# Altium schematic sheet 780-00055, rev1, Pg1, SCH, NRES Temp Meas, 8-Chan RTD .SchDoc
size B; PageSetup: Record=PageOptions|CenterHorizontal=True|CenterVertical=True|PrintScale=1.09|XCorrection=1.00|YCorrection=1.00|PrintKind=0|BorderSize=5000000|LeftOffset=0|BottomOffset=0|Orientation=2|PaperLength=1000|PaperWidth=1000|Scale=100|PaperSource=7|PrintQuality=-4|MediaType=1|DitherType=10|PaperKind=Ledger|PrintScaleMode=1
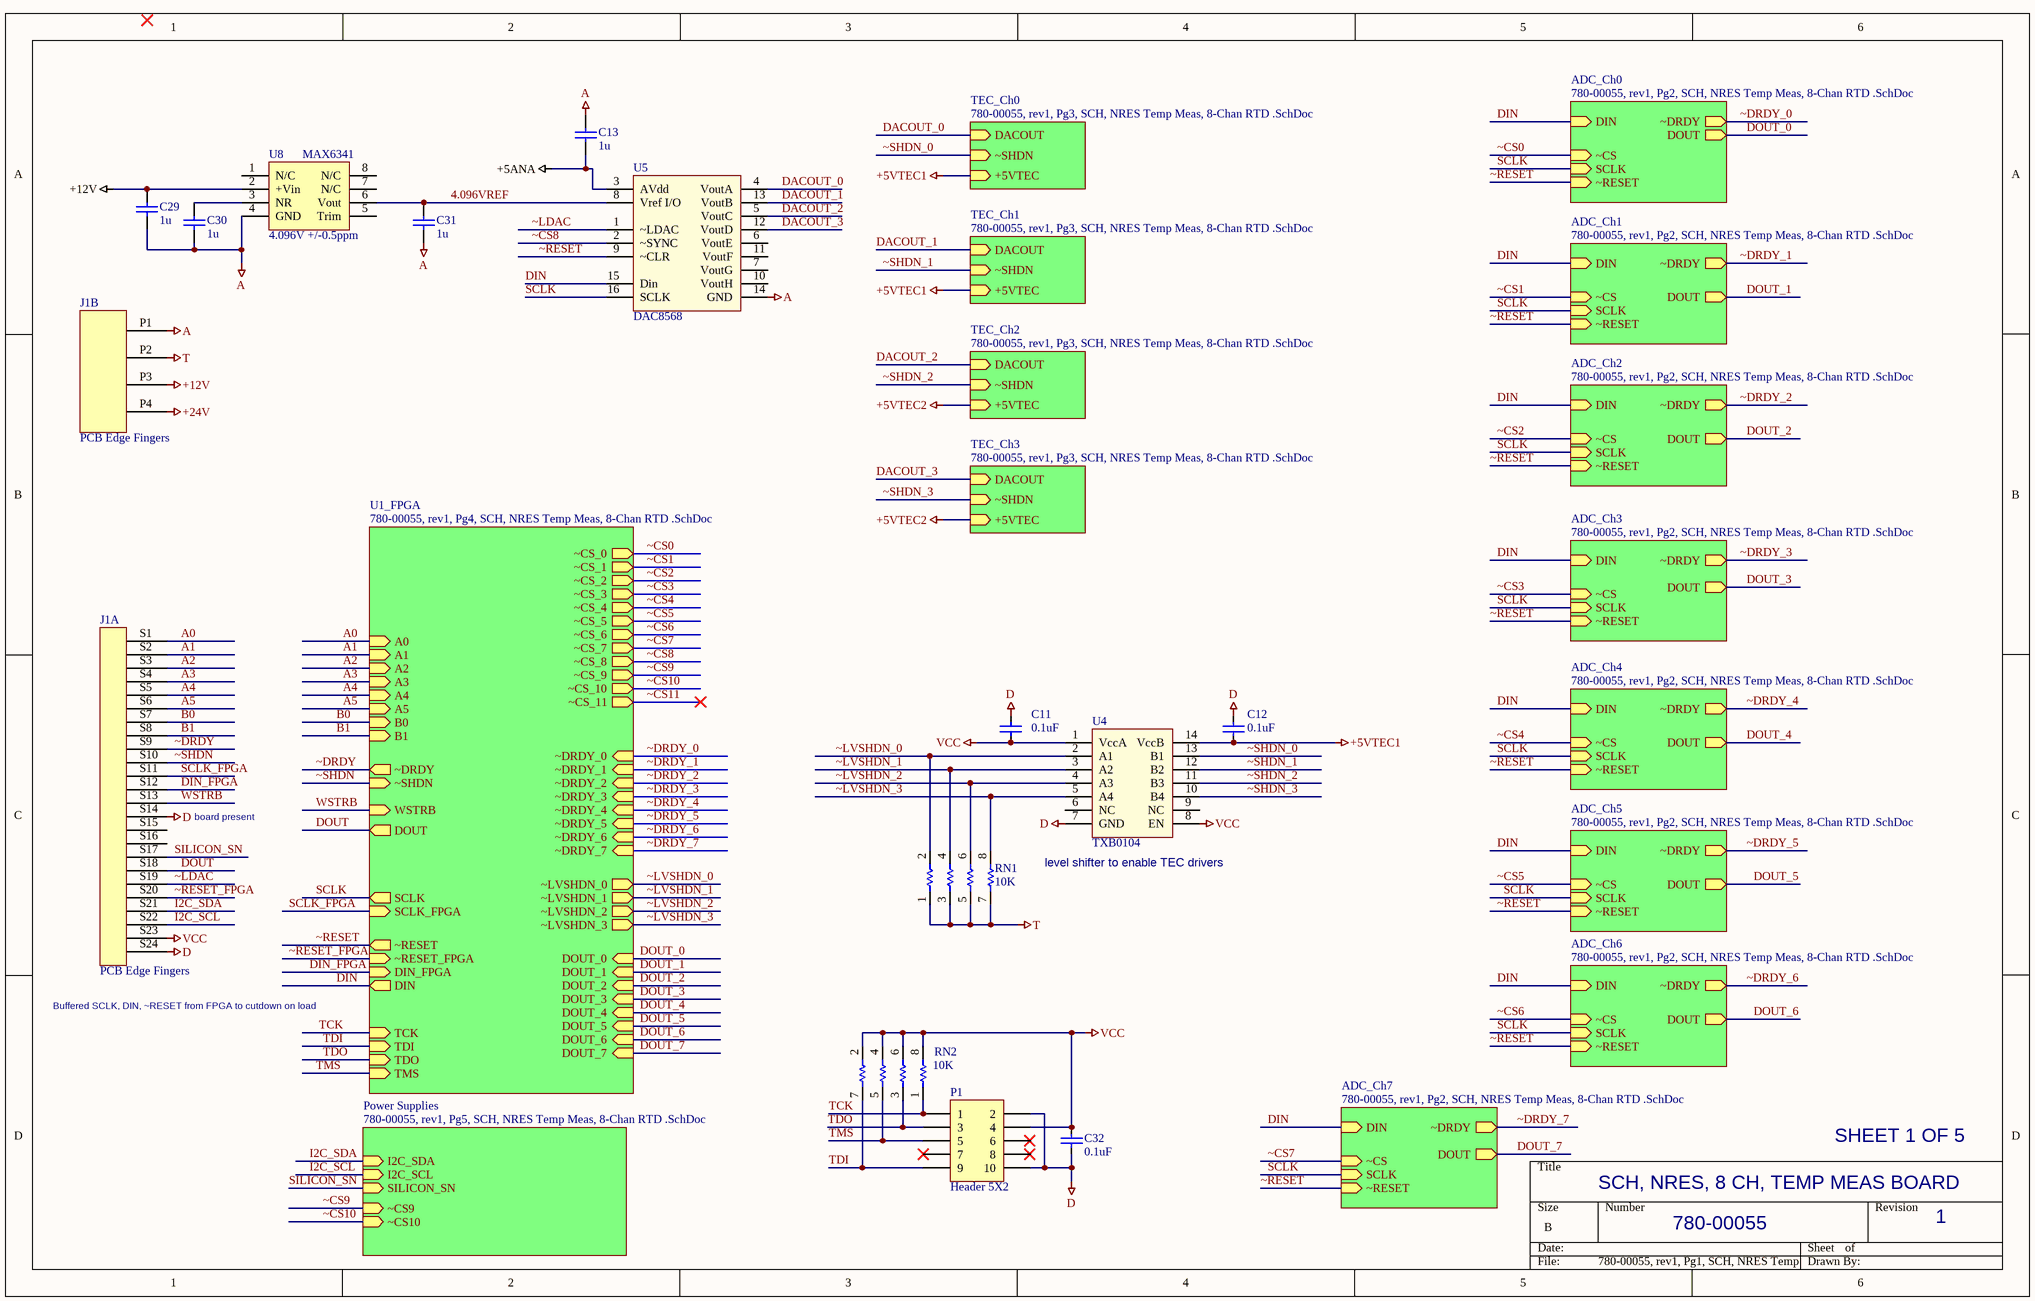
[diagram p0: 780-00055, rev1, Pg1, SCH, NRES Temp Meas, 8-Chan RTD .SchDoc]

## Parts
C11  value 0.1uF  [SMD_0805]  (hidden comment: Cap SMD)
C12  value 0.1uF  [SMD_0805]  (hidden comment: Cap SMD)
C13  1u  [SMD_0805]
C29  1u  [SMD_0805]
C30  1u  [SMD_0805]
C31  1u  [SMD_0805]
C32  value 0.1uF  [SMD_0805]  (hidden comment: Cap SMD)
J1  PCB Edge Fingers  [PCB EDGE, MOLEX 46114]  (parts A,B of 2)
P1  Header 5X2  [HDR2X5]
RN1  value 10K  [RES ARRAY 0603 x 4]  (hidden comment: RES ARRAY  x4 10K)
RN2  value 10K  [RES ARRAY 0603 x 4]  (hidden comment: RES ARRAY  x4)
U4  TXB0104  [TSSOP14]
U5  DAC8568  [TSSOP16]
U8  4.096V +/-0.5ppm  value MAX6341  [SO-8_M]

## Sub-sheets
ADC_Ch0 = 780-00055, rev1, Pg2, SCH, NRES Temp Meas, 8-Chan RTD .SchDoc: SCLK (in), ~RESET (in), DIN (in), ~DRDY (out), DOUT (out), ~CS (in)
ADC_Ch1 = 780-00055, rev1, Pg2, SCH, NRES Temp Meas, 8-Chan RTD .SchDoc: SCLK (in), ~RESET (in), DIN (in), ~DRDY (out), ~CS (in), DOUT (out)
ADC_Ch2 = 780-00055, rev1, Pg2, SCH, NRES Temp Meas, 8-Chan RTD .SchDoc: SCLK (in), ~RESET (in), DIN (in), ~DRDY (out), ~CS (in), DOUT (out)
ADC_Ch3 = 780-00055, rev1, Pg2, SCH, NRES Temp Meas, 8-Chan RTD .SchDoc: SCLK (in), ~RESET (in), DIN (in), ~DRDY (out), ~CS (in), DOUT (out)
ADC_Ch4 = 780-00055, rev1, Pg2, SCH, NRES Temp Meas, 8-Chan RTD .SchDoc: SCLK (in), ~RESET (in), DIN (in), ~DRDY (out), ~CS (in), DOUT (out)
ADC_Ch5 = 780-00055, rev1, Pg2, SCH, NRES Temp Meas, 8-Chan RTD .SchDoc: SCLK (in), ~RESET (in), DIN (in), ~DRDY (out), ~CS (in), DOUT (out)
ADC_Ch6 = 780-00055, rev1, Pg2, SCH, NRES Temp Meas, 8-Chan RTD .SchDoc: SCLK (in), ~RESET (in), DIN (in), ~DRDY (out), ~CS (in), DOUT (out)
ADC_Ch7 = 780-00055, rev1, Pg2, SCH, NRES Temp Meas, 8-Chan RTD .SchDoc: SCLK (in), ~RESET (in), DIN (in), ~DRDY (out), ~CS (in), DOUT (out)
Power Supplies = 780-00055, rev1, Pg5, SCH, NRES Temp Meas, 8-Chan RTD .SchDoc: I2C_SDA (in), I2C_SCL (in), SILICON_SN (in), ~CS9 (in), ~CS10 (in)
TEC_Ch0 = 780-00055, rev1, Pg3, SCH, NRES Temp Meas, 8-Chan RTD .SchDoc: ~SHDN (in), DACOUT (in), +5VTEC (in)
TEC_Ch1 = 780-00055, rev1, Pg3, SCH, NRES Temp Meas, 8-Chan RTD .SchDoc: ~SHDN (in), DACOUT (in), +5VTEC (in)
TEC_Ch2 = 780-00055, rev1, Pg3, SCH, NRES Temp Meas, 8-Chan RTD .SchDoc: ~SHDN (in), DACOUT (in), +5VTEC (in)
TEC_Ch3 = 780-00055, rev1, Pg3, SCH, NRES Temp Meas, 8-Chan RTD .SchDoc: ~SHDN (in), DACOUT (in), +5VTEC (in)
U1_FPGA = 780-00055, rev1, Pg4, SCH, NRES Temp Meas, 8-Chan RTD .SchDoc: ~CS_0 (out), ~CS_1 (out), ~CS_2 (out), ~CS_3 (out), ~CS_4 (out), ~CS_5 (out), ~CS_6 (out), ~CS_7 (out), ~CS_8 (out), ~DRDY (out), ~DRDY_0 (in), ~DRDY_1 (in), ~DRDY_2 (in), ~DRDY_3 (in), ~DRDY_4 (in), ~DRDY_5 (in), ~DRDY_6 (in), ~DRDY_7 (in), ~LVSHDN_0 (out), ~LVSHDN_1 (out), ~LVSHDN_2 (out), ~LVSHDN_3 (out), ~SHDN (in), A0 (in), A1 (in), A2 (in), A3 (in), A4 (in), A5 (in), B0 (in), B1 (in), TCK (in), TDI (in), TDO (in), TMS (in), WSTRB (in), DOUT (out), ~CS_9 (out), ~CS_10 (out), ~CS_11 (out), DOUT_2 (in), DOUT_4 (in), DOUT_1 (in), DOUT_6 (in), DOUT_3 (in), DOUT_7 (in), DOUT_0 (in), DOUT_5 (in), SCLK (out), SCLK_FPGA (in), ~RESET (out), ~RESET_FPGA (in), DIN_FPGA (in), DIN (out)

## Nets
+5ANA: C13.2 U5.3(AVdd)
+5VTEC1: C12.1 U4.14(VccB) ; sheet TEC_Ch0/+5VTEC, sheet TEC_Ch1/+5VTEC
+5VTEC2: sheet TEC_Ch2/+5VTEC, sheet TEC_Ch3/+5VTEC
+12V: C29.1 J1.P3(S27) U8.2(+Vin)
+24V: J1.P4(S28)
A: C13.1 C29.2 C30.2 C31.2 J1.P1(S25) U5.14(GND) U8.4(GND)
D: C11.2 C12.2 C32.1 J1.S14 J1.S24 P1.2 P1.10 U4.7(GND)
T: J1.P2(S26) RN1.1 RN1.3 RN1.5 RN1.7
VCC: C11.1 C32.2 J1.S23 P1.4 RN2.2 RN2.4 RN2.6 RN2.8 U4.1(VccA) U4.8(EN)
4.096VREF: C31.1 U5.8(Vref_I/O) U8.6(Vout)
A0: J1.S1 ; sheet U1_FPGA/A0
A1: J1.S2 ; sheet U1_FPGA/A1
A2: J1.S3 ; sheet U1_FPGA/A2
A3: J1.S4 ; sheet U1_FPGA/A3
A4: J1.S5 ; sheet U1_FPGA/A4
A5: J1.S6 ; sheet U1_FPGA/A5
B0: J1.S7 ; sheet U1_FPGA/B0
B1: J1.S8 ; sheet U1_FPGA/B1
DACOUT_0: U5.4(VoutA) ; sheet TEC_Ch0/DACOUT
DACOUT_1: U5.13(VoutB) ; sheet TEC_Ch1/DACOUT
DACOUT_2: U5.5(VoutC) ; sheet TEC_Ch2/DACOUT
DACOUT_3: U5.12(VoutD) ; sheet TEC_Ch3/DACOUT
DIN: U5.15(Din) ; sheet ADC_Ch3/DIN, sheet ADC_Ch4/DIN, sheet ADC_Ch5/DIN, sheet ADC_Ch6/DIN, sheet ADC_Ch7/DIN, sheet ADC_Ch0/DIN, sheet ADC_Ch1/DIN, sheet ADC_Ch2/DIN, sheet U1_FPGA/DIN
DIN_FPGA: J1.S12 ; sheet U1_FPGA/DIN_FPGA
DOUT: J1.S18 ; sheet U1_FPGA/DOUT
DOUT_0: sheet ADC_Ch0/DOUT, sheet U1_FPGA/DOUT_0
DOUT_1: sheet ADC_Ch1/DOUT, sheet U1_FPGA/DOUT_1
DOUT_2: sheet ADC_Ch2/DOUT, sheet U1_FPGA/DOUT_2
DOUT_3: sheet ADC_Ch3/DOUT, sheet U1_FPGA/DOUT_3
DOUT_4: sheet ADC_Ch4/DOUT, sheet U1_FPGA/DOUT_4
DOUT_5: sheet ADC_Ch5/DOUT, sheet U1_FPGA/DOUT_5
DOUT_6: sheet ADC_Ch6/DOUT, sheet U1_FPGA/DOUT_6
DOUT_7: sheet ADC_Ch7/DOUT, sheet U1_FPGA/DOUT_7
I2C_SCL: J1.S22 ; sheet Power Supplies/I2C_SCL
I2C_SDA: J1.S21 ; sheet Power Supplies/I2C_SDA
SCLK: U5.16(SCLK) ; sheet ADC_Ch3/SCLK, sheet ADC_Ch4/SCLK, sheet ADC_Ch5/SCLK, sheet ADC_Ch6/SCLK, sheet ADC_Ch7/SCLK, sheet ADC_Ch0/SCLK, sheet ADC_Ch1/SCLK, sheet ADC_Ch2/SCLK, sheet U1_FPGA/SCLK
SCLK_FPGA: J1.S11 ; sheet U1_FPGA/SCLK_FPGA
SILICON_SN: J1.S17 ; sheet Power Supplies/SILICON_SN
TCK: P1.1 RN2.1 ; sheet U1_FPGA/TCK
TDI: P1.9 RN2.7 ; sheet U1_FPGA/TDI
TDO: P1.3 RN2.3 ; sheet U1_FPGA/TDO
TMS: P1.5 RN2.5 ; sheet U1_FPGA/TMS
WSTRB: J1.S13 ; sheet U1_FPGA/WSTRB
~CS0: sheet ADC_Ch0/~CS, sheet U1_FPGA/~CS_0
~CS1: sheet ADC_Ch1/~CS, sheet U1_FPGA/~CS_1
~CS2: sheet ADC_Ch2/~CS, sheet U1_FPGA/~CS_2
~CS3: sheet ADC_Ch3/~CS, sheet U1_FPGA/~CS_3
~CS4: sheet ADC_Ch4/~CS, sheet U1_FPGA/~CS_4
~CS5: sheet ADC_Ch5/~CS, sheet U1_FPGA/~CS_5
~CS6: sheet ADC_Ch6/~CS, sheet U1_FPGA/~CS_6
~CS7: sheet ADC_Ch7/~CS, sheet U1_FPGA/~CS_7
~CS8: U5.2(~SYNC) ; sheet U1_FPGA/~CS_8
~CS9: sheet U1_FPGA/~CS_9, sheet Power Supplies/~CS9
~CS10: sheet U1_FPGA/~CS_10, sheet Power Supplies/~CS10
~CS11: sheet U1_FPGA/~CS_11
~DRDY: J1.S9 ; sheet U1_FPGA/~DRDY
~DRDY_0: sheet ADC_Ch0/~DRDY, sheet U1_FPGA/~DRDY_0
~DRDY_1: sheet ADC_Ch1/~DRDY, sheet U1_FPGA/~DRDY_1
~DRDY_2: sheet ADC_Ch2/~DRDY, sheet U1_FPGA/~DRDY_2
~DRDY_3: sheet ADC_Ch3/~DRDY, sheet U1_FPGA/~DRDY_3
~DRDY_4: sheet ADC_Ch4/~DRDY, sheet U1_FPGA/~DRDY_4
~DRDY_5: sheet ADC_Ch5/~DRDY, sheet U1_FPGA/~DRDY_5
~DRDY_6: sheet ADC_Ch6/~DRDY, sheet U1_FPGA/~DRDY_6
~DRDY_7: sheet ADC_Ch7/~DRDY, sheet U1_FPGA/~DRDY_7
~LDAC: J1.S19 U5.1(~LDAC)
~LVSHDN_0: RN1.2 U4.2(A1) ; sheet U1_FPGA/~LVSHDN_0
~LVSHDN_1: RN1.4 U4.3(A2) ; sheet U1_FPGA/~LVSHDN_1
~LVSHDN_2: RN1.6 U4.4(A3) ; sheet U1_FPGA/~LVSHDN_2
~LVSHDN_3: RN1.8 U4.5(A4) ; sheet U1_FPGA/~LVSHDN_3
~RESET: U5.9(~CLR) ; sheet ADC_Ch3/~RESET, sheet ADC_Ch4/~RESET, sheet ADC_Ch5/~RESET, sheet ADC_Ch6/~RESET, sheet ADC_Ch7/~RESET, sheet ADC_Ch0/~RESET, sheet ADC_Ch1/~RESET, sheet ADC_Ch2/~RESET, sheet U1_FPGA/~RESET
~RESET_FPGA: J1.S20 ; sheet U1_FPGA/~RESET_FPGA
~SHDN: J1.S10 ; sheet U1_FPGA/~SHDN
~SHDN_0: U4.13(B1) ; sheet TEC_Ch0/~SHDN
~SHDN_1: U4.12(B2) ; sheet TEC_Ch1/~SHDN
~SHDN_2: U4.11(B3) ; sheet TEC_Ch2/~SHDN
~SHDN_3: U4.10(B4) ; sheet TEC_Ch3/~SHDN
NetC30_1: C30.1 U8.3(NR)

Not connected (* = marked no-connect by the designer): J1 S15 S16; P1 6 7* 8; U4 6(NC) 9(NC); U5 6(VoutE) 7(VoutG) 10(VoutH) 11(VoutF); U8 1(N/C) 5(Trim) 7(N/C) 8(N/C)

## Notes on the sheet
- board present
- level shifter to enable TEC drivers
- (near J1) Buffered SCLK, DIN, ~RESET from FPGA to cutdown on load
- SCH, NRES, 8 CH, TEMP MEAS BOARD
- SHEET 1 OF 5
- 780-00055
- 1

## Library data of the parts
C11 C12 = Cap SMD: Capacitor; LCO p/n: 120-00002
C13 C29-C31 = Cap: Capacitor; Manufacturer: Taiyo Yuden; Manuf p/n: UMK212F105ZG-T; Vendor: DIGIKEY; Vendor Mult.: 10; Vendor p/n: 587-1308-1-ND; LCO p/n: 120-00027; Value: 1u; COST: 0.088
C32 = Cap SMD: Capacitor; Manufacturer: AVX; Manuf p/n: 08055C104KAT2A; Vendor: DigiKey; Vendor p/n: 478-1395-1-ND; Vendor Mult.: 10; LCO P/N: 120-00002; COST: 0.088
J1 = Conn, PCB Card Edge / Molex 46114, 24 sig / 4 pwr: PCB Edge Conn to fit Molex 46114 backplane connector
P1 = Header 5X2: Header, 5-Pin, Dual row; Manufacturer: FCI; Manuf p/n: 67996-210HLF; Vendor: DigiKey; Vendor p/n: 609-3212-ND; Vendor Mult.: 1; LCO P/N: 125-00010; COST: 0.81; Value: Header 5X2
RN1 = RES ARRAY  x4 10K: Resistor Array 4 Isolated; Manufacturer: PANASONIC - ECG; Manuf p/n: EXB-38V103JV; Vendor: DIGIKEY; Vendor p/n: Y9103CT-ND; Vendor Mult.: 10; LCO p/n: 180-00043; COST: 0.03
RN2 = RES ARRAY  x4: Resistor Array 4 Isolated; Manufacturer: Panasonic ECG; Manuf p/n: EXB-38V103JV; Vendor: DigiKey; Vendor p/n: Y9103CT-ND; Vendor Mult.: 10; LCO P/N: 180-00043; COST: 0.031
U4 = TXB0104: 4-Chan Logic Level Shifter Bi-directional; Manufacturer: TI; Manuf p/n: TXB0104PWR; LCO p/n: 150-00108; Vendor: DK; Vendor p/n: 296-21929-1-ND; VALUE: TXB0104
U5 = DAC8568: 8 Chan, 16-bit DAC, SPI Interface; Manufacturer: TI; Manuf p/n: DAC8568IAPW; LCO p/n: 150-00107; Vendor: DK; Vendor p/n: 296-24444-5-ND; VALUE: DAC8568
U8 = MAX6341: VREF 4.096V 0.5ppm; Manufacturer: MAXIM; Manuf p/n: MAX6341CSA+; Vendor: DIGIKEY; Vendor p/n: MAX6341CSA+-ND; Vendor Mult.: 1; LCO p/n: 150-00052; COST: 17.76